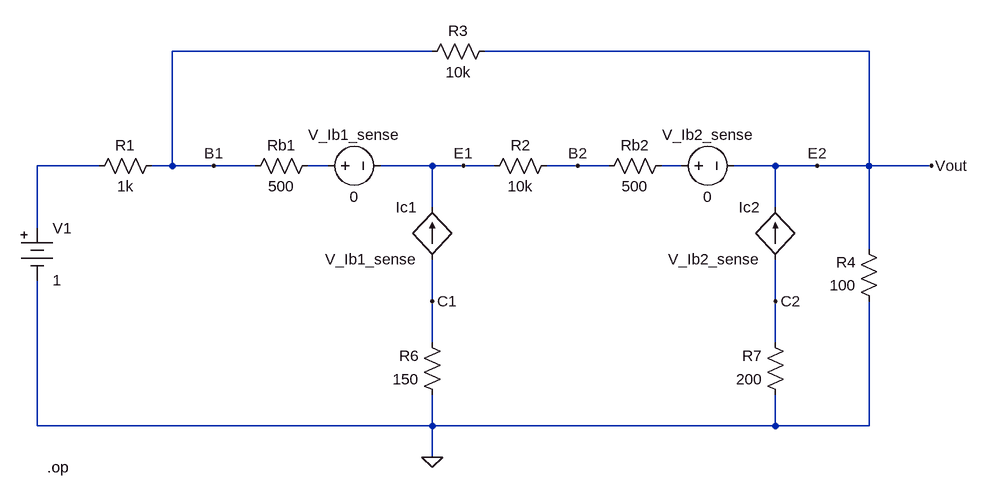
[diagram p0: schematic g3_p28.asc]
g3_p28.asc, the LTspice schematic file:
Version 4
SHEET 1 1112 680
WIRE 272 -112 -128 -112
WIRE 944 -112 352 -112
WIRE -240 64 -336 64
WIRE -128 64 -128 -112
WIRE -128 64 -160 64
WIRE -64 64 -128 64
WIRE 0 64 -64 64
WIRE 112 64 80 64
WIRE 272 64 192 64
WIRE 320 64 272 64
WIRE 368 64 320 64
WIRE 496 64 448 64
WIRE 544 64 496 64
WIRE 656 64 624 64
WIRE 800 64 736 64
WIRE 864 64 800 64
WIRE 944 64 944 -112
WIRE 944 64 864 64
WIRE 1040 64 944 64
WIRE 272 128 272 64
WIRE 800 128 800 64
WIRE -336 160 -336 64
WIRE 944 192 944 64
WIRE 272 272 272 208
WIRE 800 272 800 208
WIRE 272 336 272 272
WIRE 800 336 800 272
WIRE -336 464 -336 240
WIRE 272 464 272 416
WIRE 272 464 -336 464
WIRE 800 464 800 416
WIRE 800 464 272 464
WIRE 944 464 944 272
WIRE 944 464 800 464
WIRE 272 512 272 464
FLAG 272 512 0
FLAG 1040 64 Vout
FLAG 800 272 C2
FLAG 864 64 E2
FLAG 496 64 B2
FLAG 320 64 E1
FLAG 272 272 C1
FLAG -64 64 B1
SYMBOL Misc\\battery -336 144 R0
SYMATTR InstName V1
SYMATTR Value 1
SYMBOL f 272 208 R180
WINDOW 0 24 80 Left 2
WINDOW 3 24 0 Left 2
SYMATTR InstName Ic1
SYMATTR Value V_Ib1_sense
SYMATTR Value2 100
SYMBOL f 800 208 R180
WINDOW 0 24 80 Left 2
WINDOW 3 24 0 Left 2
SYMATTR InstName Ic2
SYMATTR Value V_Ib2_sense
SYMATTR Value2 100
SYMBOL voltage 96 64 R270
WINDOW 0 32 56 VTop 2
WINDOW 3 -32 56 VBottom 2
SYMATTR InstName V_Ib1_sense
SYMATTR Value 0
SYMBOL voltage 640 64 R270
WINDOW 0 32 56 VTop 2
WINDOW 3 -32 56 VBottom 2
SYMATTR InstName V_Ib2_sense
SYMATTR Value 0
SYMBOL res 96 48 R90
WINDOW 0 0 56 VBottom 2
WINDOW 3 32 56 VTop 2
SYMATTR InstName Rb1
SYMATTR Value 500
SYMBOL res 288 432 R180
WINDOW 0 36 76 Left 2
WINDOW 3 36 40 Left 2
SYMATTR InstName R6
SYMATTR Value 150
SYMBOL res 464 48 R90
WINDOW 0 0 56 VBottom 2
WINDOW 3 32 56 VTop 2
SYMATTR InstName R2
SYMATTR Value 10k
SYMBOL res 368 -128 R90
WINDOW 0 0 56 VBottom 2
WINDOW 3 32 56 VTop 2
SYMATTR InstName R3
SYMATTR Value 10k
SYMBOL res 960 288 R180
WINDOW 0 36 76 Left 2
WINDOW 3 36 40 Left 2
SYMATTR InstName R4
SYMATTR Value 100
SYMBOL res 816 432 R180
WINDOW 0 36 76 Left 2
WINDOW 3 36 40 Left 2
SYMATTR InstName R7
SYMATTR Value 200
SYMBOL res 640 48 R90
WINDOW 0 0 56 VBottom 2
WINDOW 3 32 56 VTop 2
SYMATTR InstName Rb2
SYMATTR Value 500
SYMBOL res -144 48 R90
WINDOW 0 0 56 VBottom 2
WINDOW 3 32 56 VTop 2
SYMATTR InstName R1
SYMATTR Value 1k
TEXT -320 528 Left 2 !.op

The netlist it stands for:
* g3_p28.asc
V1 N001 0 1
F§Ic1 C1 E1 V_Ib1_sense 100
F§Ic2 C2 E2 V_Ib2_sense 100
V_Ib1_sense N002 E1 0
V_Ib2_sense N003 E2 0
Rb1 N002 B1 500
R6 0 C1 150
R2 B2 E1 10k
R3 E2 B1 10k
R4 0 E2 100
R7 0 C2 200
Rb2 N003 B2 500
R1 B1 N001 1k
.op
.backanno
.end